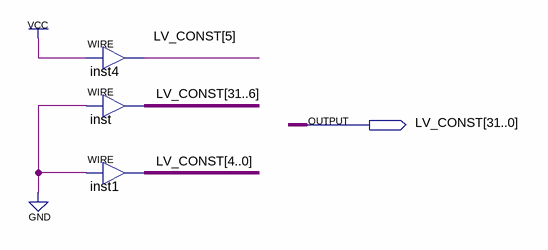
[diagram p0: schematic sheet]
// Quartus schematic LV_const.bdf as structural Verilog: 3 symbols, 1 pins
module LV_const (
  output [31:0] LV_CONST
);

  assign LV_CONST[5] = 1'b1;  // WIRE inst4
  assign LV_CONST[31:6] = {26{1'b0}};  // WIRE inst
  assign LV_CONST[4:0] = {5{1'b0}};  // WIRE inst1
endmodule
